# EAGLE design Control de Juez V1.0.0 (EAGLE 9.6.2)
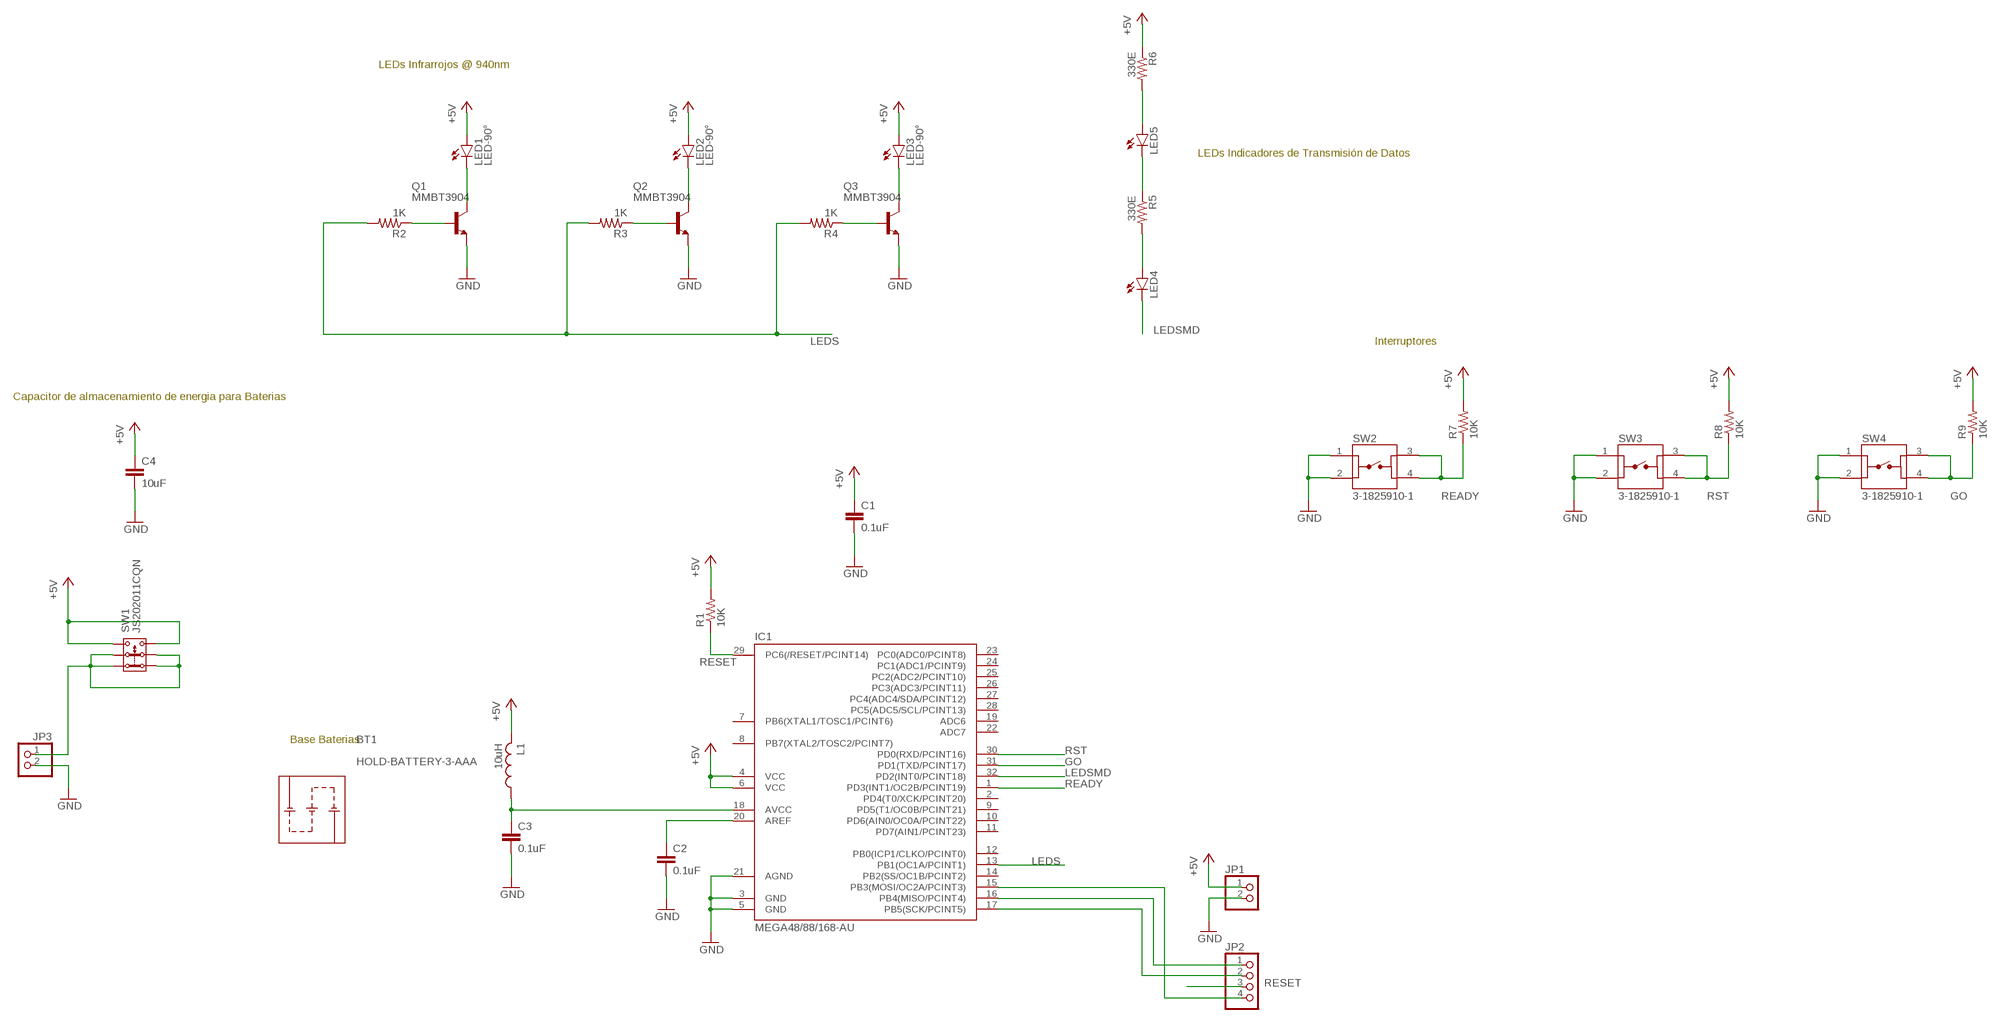
[diagram p0: schematic, sheet 1]

## Parts
BT1  HOLD-BATTERY-3-AAA  [HOLDER-3-AAA]
C1  0.1uF  C-EUC0603  [C0603]
C2  0.1uF  C-EUC0603  [C0603]
C3  0.1uF  C-EUC0603  [C0603]
C4  10uF  C-EUC0603  [C0603]
IC1  MEGA48/88/168-AU  [TQFP32-08]
JP1  PINHD-1X02_2.54-S  [1X02-S]
JP2  PINHD-1X04_2.54-S  [1X04-S]
JP3  PINHD-1X02_2.54-S  [1X02-S]
L1  10uH  L-USL1812  [L1812]
LED1  LED-90°  [LED-90°]
LED2  LED-90°  [LED-90°]
LED3  LED-90°  [LED-90°]
LED4  LEDCHIP-LED0603  [CHIP-LED0603]
LED5  LEDCHIP-LED0603  [CHIP-LED0603]
Q1  MMBT3904  [SOT23]
Q2  MMBT3904  [SOT23]
Q3  MMBT3904  [SOT23]
R1  10K  R-US_R0603  [R0603]
R2  1K  R-US_R0603  [R0603]
R3  1K  R-US_R0603  [R0603]
R4  1K  R-US_R0603  [R0603]
R5  330E  R-US_R0603  [R0603]
R6  330E  R-US_R0603  [R0603]
R7  10K  R-US_R0603  [R0603]
R8  10K  R-US_R0603  [R0603]
R9  10K  R-US_R0603  [R0603]
SW1  JS202011CQN  [PTH]
SW2  3-1825910-1  [TE_3-1825910-1]
SW3  3-1825910-1  [TE_3-1825910-1]
SW4  3-1825910-1  [TE_3-1825910-1]

## Nets
+5V: C1.1 C4.1 IC1.4(VCC) IC1.6(VCC) JP1.1 L1.2 LED1.1(A) LED2.1(A) LED3.1(A) R1.2 R6.1 R7.2 R8.2 R9.2 SW1.3.1 SW1.3.2
GND: C1.2 C2.2 C3.2 C4.2 IC1.3(GND) IC1.5(GND) IC1.21(AGND) JP1.2 JP3.2 Q1.E Q2.E Q3.E SW2.1 SW2.2 SW3.1 SW3.2 SW4.1 SW4.2
GO: IC1.31(PD1(TXD/PCINT17)) R9.1 SW4.3 SW4.4
LEDS: IC1.13(PB1(OC1A/PCINT1)) R2.2 R3.2 R4.2
LEDSMD: IC1.32(PD2(INT0/PCINT18)) LED4.C
N$1: IC1.15(PB3(MOSI/OC2A/PCINT3)) JP2.4
N$2: C3.1 IC1.18(AVCC) L1.1
N$3: C2.1 IC1.20(AREF)
N$4: IC1.16(PB4(MISO/PCINT4)) JP2.1
N$5: IC1.17(PB5(SCK/PCINT5)) JP2.2
N$6: JP3.1 SW1.1.1 SW1.1.2 SW1.2.1 SW1.2.2
N$7: LED1.2(C) Q1.C
N$8: LED2.2(C) Q2.C
N$9: LED3.2(C) Q3.C
N$10: Q3.B R4.1
N$11: Q2.B R3.1
N$12: Q1.B R2.1
N$13: LED5.C R5.1
N$14: LED5.A R6.2
N$15: LED4.A R5.2
READY: IC1.1(PD3(INT1/OC2B/PCINT19)) R7.1 SW2.3 SW2.4
RESET: IC1.29(PC6(/RESET/PCINT14)) JP2.3 R1.1
RST: IC1.30(PD0(RXD/PCINT16)) R8.1 SW3.3 SW3.4
Unconnected: IC1.2(PD4(T0/XCK/PCINT20)) IC1.7(PB6(XTAL1/TOSC1/PCINT6)) IC1.8(PB7(XTAL2/TOSC2/PCINT7)) IC1.9(PD5(T1/OC0B/PCINT21)) IC1.10(PD6(AIN0/OC0A/PCINT22)) IC1.11(PD7(AIN1/PCINT23)) IC1.12(PB0(ICP1/CLKO/PCINT0)) IC1.14(PB2(SS/OC1B/PCINT2)) IC1.19(ADC6) IC1.22(ADC7) IC1.23(PC0(ADC0/PCINT8)) IC1.24(PC1(ADC1/PCINT9)) IC1.25(PC2(ADC2/PCINT10)) IC1.26(PC3(ADC3/PCINT11)) IC1.27(PC4(ADC4/SDA/PCINT12)) IC1.28(PC5(ADC5/SCL/PCINT13))

## Notes on the sheet
- LEDs Infrarrojos @ 940nm
- LEDs Indicadores de Transmisión de Datos
- Interruptores
- Capacitor de almacenamiento de energia para Baterias
- Base Baterias

## Library data of the parts
BT1 = BATTERY_HOLDER_3AAA-C9091:HOLD-BATTERY-3-AAA
C1-C4 = rcl:C-EU: CAPACITOR, European symbol; SPICEPREFIX: C
IC1 = avr-8:MEGA48/88/168
JP1 JP3 = pinhead-2:PINHD-1X02: PIN HEADER
JP2 = pinhead-2:PINHD-1X04: PIN HEADER
L1 = rcl:L-US: INDUCTOR, American symbol; SPICEPREFIX: L
LED1-LED3 = LED_TH-90°:LED-90°
LED4 LED5 = led:LED: LED OSRAM: - CHIPLED LG R971, LG N971, LY N971, LG Q971, LY Q971, LO R971, LY R971 LH N974, LH R974 LS Q976, LO Q976, LY Q976 LO Q996 - Hyper CHIPLED LW Q18S LB Q993, LB Q99A, LB R99A - SideLED LS A670, LO A670, LY A670, LG A670, LP A670 LB A673, LV A673, LT A673, LW A673 LH A674 LY A675 LS A676, LA A676, LO A676, LY A676, LW A676 LS A679, LY A679, LG A679 - Hyper Micro SIDELED® LS Y876, LA Y876, LO Y876, LY Y876 LT Y87S - SmartLED LW L88C, LW L88S LB L89C, LB L89S, LG L890 LS L89K, LO L89K, LY L89K LS L896, LA L896, LO L896, LY L896 - TOPLED LS T670, LO T670, LY T670, LG T670, LP T670 LSG T670, LSP T670, LSY T670, LOP T670, LYG T670 LG T671, LOG T671, LSG T671 LB T673, LV T673, LT T673, LW T673 LH T674 LS T676, LA T676, LO T676, LY T676, LB T676, LH T676, LSB T676, LW T676 LB T67C, LV T67C, LT T67C, LS T67K, LO T67K, LY T67K, LW E67C LS E67B, LA E67B, LO E67B, LY E67B, LB E67C, LV E67C, LT E67C LW T67C LS T679, LY T679, LG T679 LS T770, LO T770, LY T770, LG T770, LP T770 LB T773, LV T773, LT T773, LW T773 LH T774 LS E675, LA E675, LY E675, LS T675 LS T776, LA T776, LO T776, LY T776, LB T776 LHGB T686 LT T68C, LB T68C - Hyper Mini TOPLED® LB M676 - Mini TOPLED Santana® LG M470 LS M47K, LO M47K, LY M47K Source: http://www.osram.convergy.de LUXEON: - LUMILED® LXK2-PW12-R00, LXK2-PW12-S00, LXK2-PW14-U00, LXK2-PW14-V00 LXK2-PM12-R00, LXK2-PM12-S00, LXK2-PM14-U00 LXK2-PE12-Q00, LXK2-PE12-R00, LXK2-PE12-S00, LXK2-PE14-T00, LXK2-PE14-U00 LXK2-PB12-K00, LXK2-PB12-L00, LXK2-PB12-M00, LXK2-PB14-N00, LXK2-PB14-P00, LXK2-PB14-Q00 LXK2-PR12-L00, LXK2-PR12-M00, LXK2-PR14-Q00, LXK2-PR14-R00 LXK2-PD12-Q00, LXK2-PD12-R00, LXK2-PD12-S00 LXK2-PH12-R00, LXK2-PH12-S00 LXK2-PL12-P00, LXK2-PL12-Q00, LXK2-PL12-R00 Source: www.luxeon.com KINGBRIGHT: KA-3528ASYC Source: www.kingbright.com
Q1-Q3 = FAIRCHILD-MMBT3904_Transistor:MMBT3904: FAIRCHILD - MMBT3904 NPN General Purpose Amplifier Description This Device is designed as a general purpose amplifier and switch. The useful dynamic range extends to 100mA as a switch and to 100MHz as an amplifier. Library made By: SOLACE LABS - Applied Research in Motion.
R1-R9 = rcl:R-US_: RESISTOR, American symbol; SPICEPREFIX: R
SW1 = C&K-Slider_Switch:JS202011CQN: C&K Components - JS Series Sub-Miniature Slide Switches ￼Features/Benefits • Positive detent • Low profile • IR reflow to 260o solder profile • Surface and thru hole mounting • SPDT, DPDT, DP3T models • RoHS compliant Specifications CONTACT RATING: See individual series for information. ELECTRICAL LIFE: See individual series for information. CONTACT RESISTANCE: 70 m Ω max. INSULATION RESISTANCE: 100 M Ω min. @ 500V. DIELECTRIC STRENGTH: 500 VAC min. @ sea level. OPERATING TEMPERATURE: -40oC to +85oC STORAGE TEMPERATURE: -40oC to +85oC NOTE: Specifications and materials listed above are for switches with standard options. For information on specific and custom switches, consult Customer Service Center. Library Made By: SOLACE LABS - Applied Research in Motion.
SW2-SW4 = TE-Push_button:3-1825910-1: Switch Tactile OFF (ON) SPST Round Button PC Pins 0.05A 24VDC 100000Cycles 1.57N Thru-Hole Loose; AVAILABILITY: Unavailable; COMMENT: 3-1825910-1; DESCRIPTION: Switch Push Button OFF _ON_ SPST Round Button 0.05A 24VDC Momentary Contact PC Pins Thru-Hole; EU_ROHS_COMPLIANCE: Compliant; MF: TE Connectivity; MP: 3-1825910-1; PACKAGE: None; PRICE: None; TE_PURCHASE_URL: https://www.te.com/usa-en/product-3-1825910-1.html?te_bu=Cor&te_type=disp&te_campaign=seda_glo_cor-seda-global-disp-prtnr-fy19-seda-model-bom-cta_sma-317_1&elqCampaignId=32493

## Board
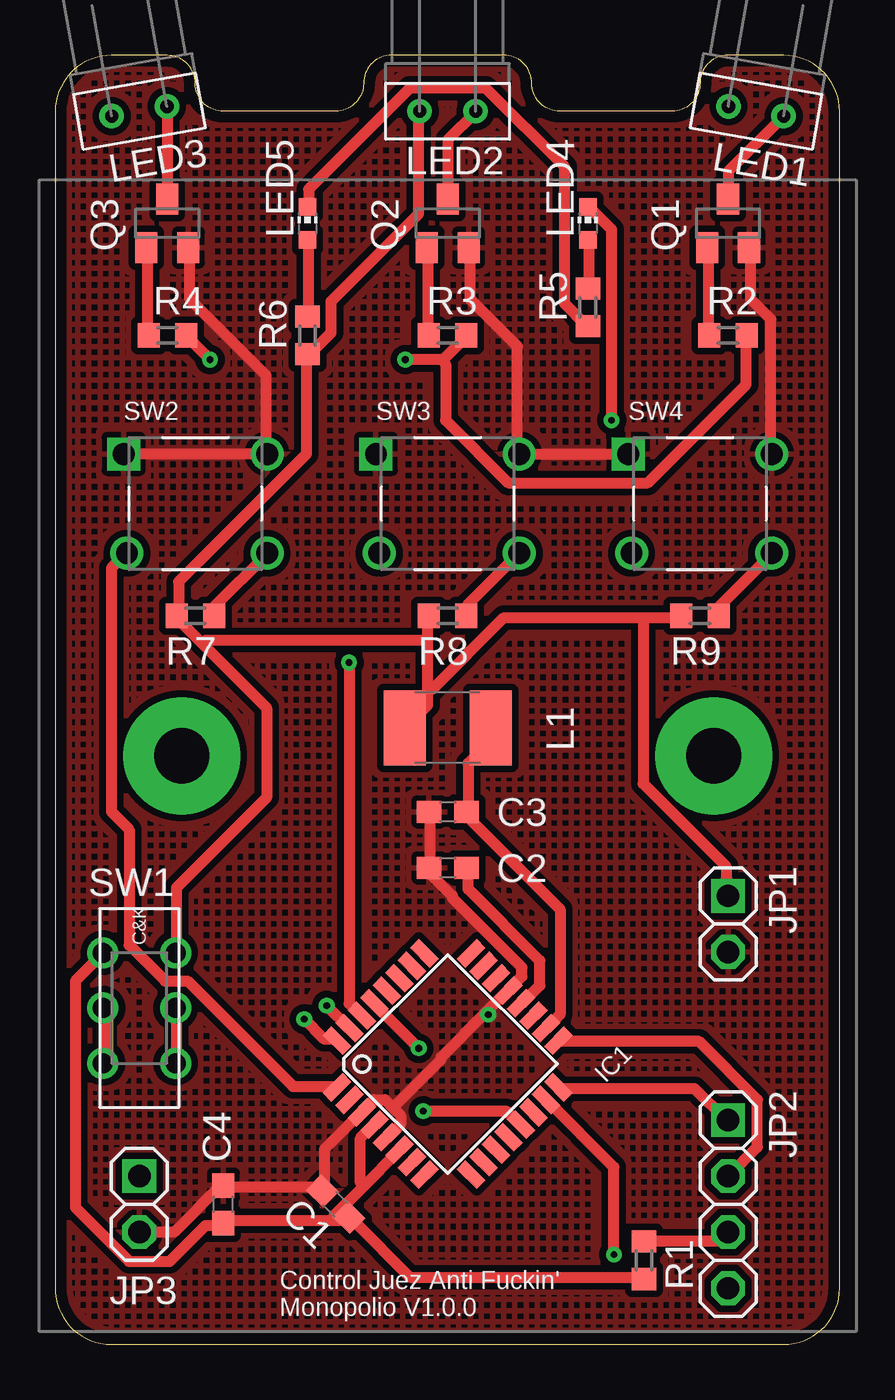
[diagram p1: board, top side]
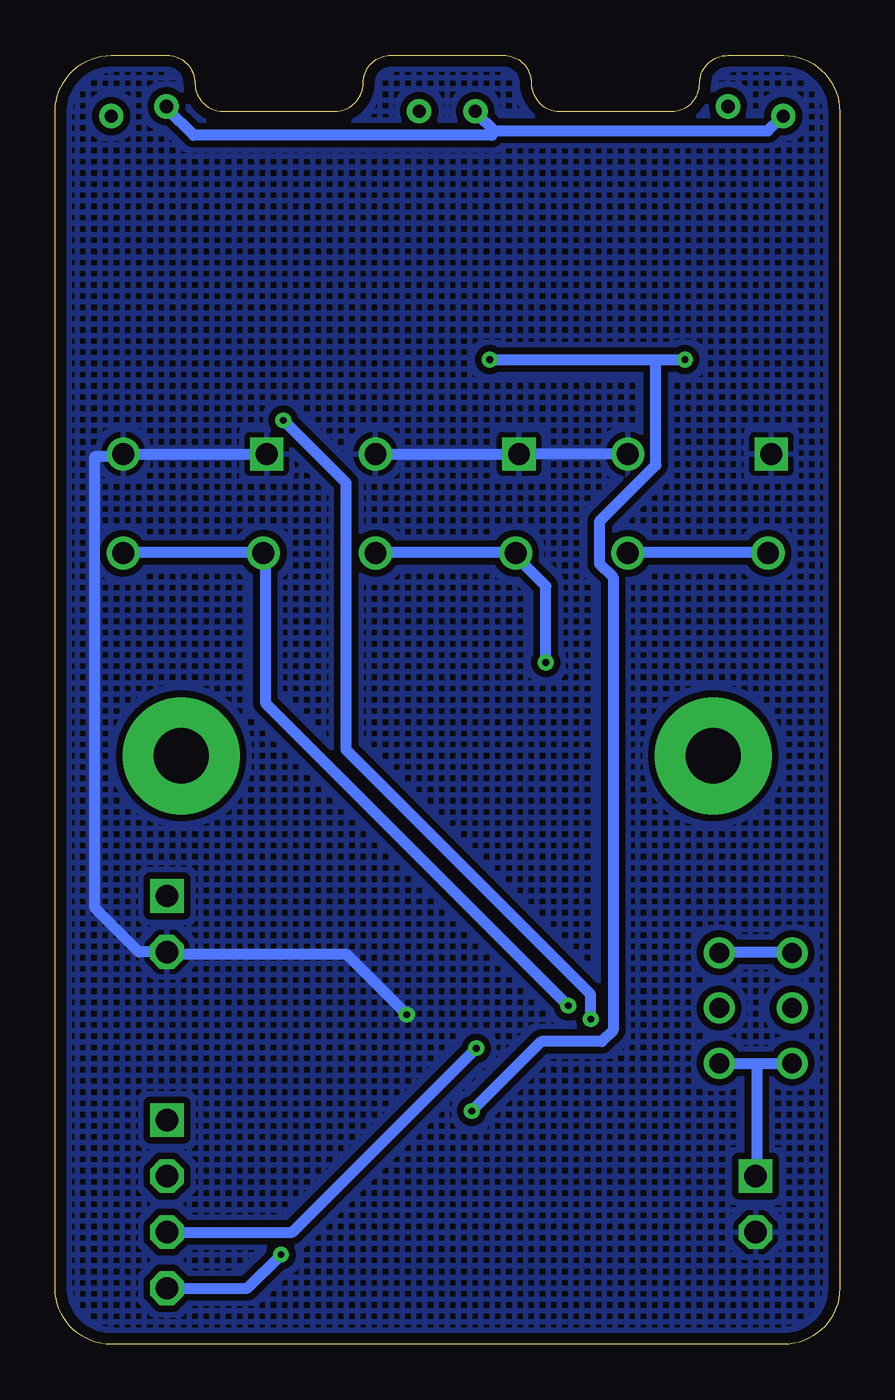
[diagram p2: board, bottom side, seen from below]

Size 35.54 x 58.42 mm. Coordinates in mm from the lower left corner, seen from the top.
Outline: 0,55.87 0,2.54 arc90 2.54,0 33,0 arc90 35.54,2.54 35.54,55.87 arc90 33,58.41 30.48,58.42 arc90 29.21,57.15 arc-90 27.94,55.88 22.86,55.88 arc-90 21.59,57.15 arc90 20.32,58.42 15.24,58.42 arc90 13.97,57.15 arc-90 12.7,55.88 7.61,55.88 arc-90 6.35,57.14 arc90 5.08,58.41 2.54,58.41 arc90 0,55.87
Copper layers (1*16): Top 0.035mm / dielectric 1.5mm / Bottom 0.035mm
Design rules "default *": minimum track width 20mil, minimum drill 12mil, track to track 9mil, track to pad 9mil, pad to pad 9mil, via to via 16mil, smd to smd 0mil, copper to edge 20mil, drill to drill 6mil, minimum pad ring 10mil, minimum via ring 8mil, stop-mask expansion 4mil, vias tented up to drill 12mil, thermal gap 10mil

### Footprints (pad centres in the part's own frame; a part is rotated, then mirrored left to right if it is on the bottom)
HOLDER-3-AAA = drill 2.5 pad 5.3: 1 -12.05,0; 2 12.05,0
C0603 = smd 1.1 x 1: 1 -0.85,0; 2 0.85,0
TQFP32-08 = smd 1.27 x 0.559: 1 -4.293,2.8; 2 -4.293,2; 3 -4.293,1.2; 4 -4.293,0.4; 5 -4.293,-0.4; 6 -4.293,-1.2; 7 -4.293,-2; 8 -4.293,-2.8; 17 4.293,-2.8; 18 4.293,-2; 19 4.293,-1.2; 20 4.293,-0.4; 21 4.293,0.4; 22 4.293,1.2; 23 4.293,2; 24 4.293,2.8 | smd 0.559 x 1.27: 9 -2.8,-4.293; 10 -2,-4.293; 11 -1.2,-4.293; 12 -0.4,-4.293; 13 0.4,-4.293; 14 1.2,-4.293; 15 2,-4.293; 16 2.8,-4.293; 25 2.8,4.293; 26 2,4.293; 27 1.2,4.293; 28 0.4,4.293; 29 -0.4,4.293; 30 -1.2,4.293; 31 -2,4.293; 32 -2.8,4.293
1X02-S = drill 1.016 square: 1 -1.27,0 | drill 1.016 octagon: 2 1.27,0
1X04-S = drill 1.016 square: 1 -3.81,0 | drill 1.016 octagon: 2 -1.27,0; 3 1.27,0; 4 3.81,0
L1812 = smd 1.9 x 3.4: 1 -1.95,0; 2 1.95,0
LED-90° = drill 0.6: 1 -1.27,0; 2 1.27,0
CHIP-LED0603 = smd 0.8 x 0.8: A 0,-0.75; C 0,0.75
SOT23 = smd 1 x 1.4: B -0.95,-1.1; C 0,1.1; E 0.95,-1.1
R0603 = smd 1 x 1.1: 1 -0.85,0; 2 0.85,0
PTH = drill 0.9: 1.1 -2.5,1.65; 1.2 -2.5,-1.65; 2.1 0,1.65; 2.2 0,-1.65; 3.1 2.5,1.65; 3.2 2.5,-1.65
TE_3-1825910-1 = drill 0.99 square: 1 -3.25,2.25 | drill 0.99: 2 3.25,2.25; 3 -3.1,-2.25; 4 3.25,-2.25

### Placement (x,y rotation side)
BT1  17.78,26.67 0 top
C1  12.7,6.35 135 top
C2  17.78,21.59 180 top
C3  17.78,24.13 180 top
C4  7.62,6.35 90 top
IC1  17.78,12.7 45 top
JP1  30.48,19.05 270 top
JP2  30.48,6.35 270 top
JP3  3.81,6.35 270 top
L1  17.78,27.94 180 top
LED1  31.75,55.88 350 top
LED2  17.78,55.88 0 top
LED3  3.81,55.88 10 top
LED4  24.13,50.8 0 top
LED5  11.43,50.8 0 top
Q1  30.48,50.8 0 top
Q2  17.78,50.8 0 top
Q3  5.08,50.8 0 top
R1  26.67,3.81 270 top
R2  30.48,45.72 0 top
R3  17.78,45.72 0 top
R4  5.08,45.72 0 top
R5  24.13,46.99 90 top
R6  11.43,45.72 90 top
R7  6.35,33.02 180 top
R8  17.78,33.02 180 top
R9  29.21,33.02 180 top
SW1  3.81,15.24 90 top
SW2  6.35,38.1 0 top
SW3  17.78,38.1 0 top
SW4  29.21,38.1 0 top

### Tracks (layer width: path | path; a pad name or v marks a point on that pad's centre or on a via)
+5V
  Top 0.508: 16.87,29.68 16.87,28.97 15.86,27.95 L1.2 | 16.87,29.68 16.87,31.91 | 16.87,31.91 16.87,32.93 R8.2 | 26.63,32.93 20.33,32.93 17.08,29.68 16.87,29.68 | 26.63,32.93 28.36,32.93 R9.2 | 26.63,32.93 26.63,25.41 30.39,21.65 30.39,20.33 JP1.1 | C1.1 13.21,5.69 13.11,5.59 7.62,5.59 C4.1 7.42,5.39 6.81,5.39 5.18,3.76 3.35,3.76 0.92,6.2 0.92,16.47 2.13,17.68 SW1.3.1 | R1.2 26.63,3.05 16.06,3.05 13.52,5.59 C1.1 | 13.98,7.17 12.6,5.79 C1.1 | 13.98,7.17 15.55,8.74 IC1.6 | IC1.4 14.43,9.96 13.82,9.35 13.82,7.32 13.98,7.17 | 6.66,31.76 5.59,32.83 R7.2 5.59,33.03 5.59,34.56 11.38,40.35 11.38,44.82 R6.1 11.59,44.92 12.5,45.84 12.5,47.26 16.47,51.23 16.47,55.8 LED2.1 | 6.66,31.76 9.58,28.84 9.58,24.77 5.49,20.68 5.49,17.79 SW1.3.2 | 16.87,31.91 6.81,31.91 6.66,31.76
  Bottom 0.508: 15.65,54.99 3.25,54.99 2.64,55.6 LED3.1 | 15.65,54.99 16.47,55.8 LED2.1 | LED1.1 30.49,56 29.27,54.78 15.75,54.78 15.65,54.99 | SW1.3.1 2.24,17.79 5.39,17.79 SW1.3.2
GND  (via drill 0.3)
  Top 0.508: C3.2 16.97,24.09 16.97,21.65 C2.2 16.97,21.34 17.99,20.33 17.99,20.23 21.14,17.08 21.14,16.67 20.63,16.16 IC1.21 20.53,16.06 19.52,15.04 | 15.3,10.72 14.94,11.08 14.43,11.08 14.03,10.67 IC1.3 13.82,10.47 12.2,8.84 12.2,7.01 C1.2 11.89,7.12 7.62,7.12 C4.2 7.42,7.12 5.39,5.08 3.86,5.08 JP3.2 | 15.3,10.72 15.65,10.37 15.65,9.96 15.04,9.35 IC1.5 | 19.52,15.04 17.48,13.01 17.48,12.91 15.45,10.88 15.3,10.72 | Q3.E 6.1,49.6 6.1,47.36 9.55,43.91 9.55,40.35 SW2.2 9.35,40.35 3.15,40.35 SW2.1 | Q2.E 18.8,49.6 18.8,47.36 20.94,45.23 20.94,40.35 SW3.2 21.24,40.35 25.92,40.35 SW4.1 | Q1.E 31.51,49.6 31.51,47.36 32.42,46.45 32.42,40.35 SW4.2 | v19.62,14.94 19.52,15.04
  Bottom 0.508: SW2.2 9.66,40.35 14.43,40.35 SW3.1 14.74,40.35 20.94,40.35 SW3.2 | 30.49,17.79 JP1.2 | SW4.1 26.02,40.35 32.22,40.35 SW4.2 32.52,40.25 33.74,40.25 33.74,19.77 31.75,17.78 JP1.2 | v19.62,14.94 22.36,17.68 30.29,17.68 JP1.2
  pour Top (isolate 0.305, hatched): 29.21,57.15 arc-90 30.48,58.42 33.02,58.42 arc-90 35.56,55.88 35.56,2.54 arc-90 33.02,0 2.54,0 arc-90 0,2.54 0,55.88 arc-90 2.54,58.42 5.08,58.42 arc-90 6.35,57.15 arc90 7.62,55.88 12.7,55.88 arc90 13.97,57.15 arc-90 15.24,58.42 20.32,58.42 arc-90 21.59,57.15 arc90 22.86,55.88 27.94,55.88 arc90
  pour Bottom (isolate 0.305, hatched): 29.21,57.15 arc-90 30.48,58.42 33.02,58.42 arc-90 35.56,55.88 35.56,2.54 arc-90 33.02,0 2.54,0 arc-90 0,2.54 0,55.88 arc-90 2.54,58.42 5.08,58.42 arc-90 6.35,57.15 arc90 7.62,55.88 12.7,55.88 arc90 13.97,57.15 arc-90 15.24,58.42 20.32,58.42 arc-90 21.59,57.15 arc90 22.86,55.88 27.94,55.88 arc90
GO  (via drill 0.3)
  Top 0.508: R9.1 30.09,33.03 30.09,33.44 32.42,35.78 SW4.4 | v12.3,15.35 13.31,14.33 IC1.31
  Bottom 0.508: v12.3,15.35 26.02,29.07 26.02,35.78 SW4.3 26.32,35.88 32.42,35.88 SW4.4
LEDS  (via drill 0.3)
  Top 0.508: v7.01,44.62 6,45.64 R4.2 | 17.58,44.62 v15.86,44.62 | 17.58,44.62 18.6,45.64 R3.2 | R2.2 31.3,45.64 31.3,43.5 26.83,39.03 20.53,39.03 17.68,41.88 17.68,44.42 17.58,44.62 | v16.67,10.57 20.43,10.57 21.04,9.96 IC1.13
  Bottom 0.508: v15.86,44.62 8.33,44.62 | 8.33,44.62 v7.01,44.62 | v16.67,10.57 13.52,13.72 10.77,13.72 10.27,14.23 10.27,34.76 10.88,35.37 10.88,37.3 8.33,39.84 8.33,44.62
LEDSMD  (via drill 0.3)
  Top 0.508: v25.21,41.88 25.21,50.52 24.19,51.53 LED4.C | v11.28,14.74 12.2,13.82 12.71,13.82 IC1.32
  Bottom 0.508: v25.21,41.88 22.36,39.03 22.36,26.93 11.28,15.86 v11.28,14.74
N$1  (via drill 0.3)
  Top 0.508: v25.31,4.07 25.31,8.03 22.26,11.08 IC1.15
  Bottom 0.508: v25.31,4.07 26.83,2.54 30.39,2.54 JP2.4
N$2
  Top 0.508: L1.1 19.72,27.85 19.72,27.34 18.7,26.32 18.7,24.19 C3.1 18.7,23.89 22.87,19.72 22.87,14.94 22.26,14.33 IC1.18
N$3
  Top 0.508: C2.1 18.7,21.55 18.7,20.63 21.95,17.38 21.95,16.26 21.14,15.45 IC1.20
N$4
  Top 0.508: IC1.16 22.87,11.59 28.97,11.59 30.39,10.16 JP2.1
N$5
  Top 0.508: IC1.17 22.87,13.72 29.17,13.72 31.81,11.08 31.81,8.94 30.49,7.62 JP2.2
N$6
  Top 0.508: SW1.1.2 5.49,12.81 5.49,15.14 SW1.2.2 | SW1.1.1 2.24,12.81 2.24,15.14 SW1.2.1
  Bottom 0.508: 3.76,12.71 3.76,7.62 JP3.1 | 3.76,12.71 2.24,12.71 SW1.1.1 | 3.76,12.71 5.39,12.71 SW1.1.2
N$7
  Top 0.508: Q1.C 30.49,51.94 30.49,53.16 32.93,55.6 LED1.2
N$8
  Top 0.508: Q2.C 17.79,51.94 17.79,54.58 19.01,55.8 LED2.2
N$9
  Top 0.508: Q3.C 5.08,51.94 5.08,56 LED3.2
N$10
  Top 0.508: R4.1 4.17,45.74 4.17,49.6 Q3.B
N$11
  Top 0.508: R3.1 16.87,45.74 16.87,49.6 Q2.B
N$12
  Top 0.508: R2.1 29.58,45.74 29.58,49.6 Q1.B
N$13
  Top 0.508: LED5.C 11.48,51.63 11.48,52.34 16.06,56.92 19.52,56.92 23.07,53.36 23.07,47.16 24.09,46.15 R5.1
N$14
  Top 0.508: LED5.A 11.48,50.01 11.48,46.65 R6.2
N$15
  Top 0.508: LED4.A 24.19,50.01 24.19,47.87 R5.2
READY
  Top 0.508: R7.1 7.22,33.03 7.22,33.44 9.55,35.78 SW2.4 | IC1.1 12.71,11.69 10.77,11.69 6,16.47 4.98,16.47 3.35,18.09 3.35,23.33 2.54,24.14 2.54,35.17 3.15,35.78 SW2.3
  Bottom 0.508: SW2.4 9.55,35.88 3.25,35.88 SW2.3
RESET  (via drill 0.3)
  Top 0.508: R1.1 26.73,4.67 30.09,4.67 30.39,4.98 JP2.3 | v16.47,13.42 14.43,15.45 IC1.29
  Bottom 0.508: v16.47,13.42 24.8,5.08 30.39,5.08 JP2.3
RST  (via drill 0.3)
  Top 0.508: R8.1 18.7,33.03 18.7,33.54 20.94,35.78 SW3.4 | v13.31,30.9 13.31,15.45 13.82,14.94 IC1.30
  Bottom 0.508: 14.64,35.78 SW3.3 14.84,35.88 | 14.84,35.88 20.94,35.88 SW3.4 | v13.31,30.9 13.31,34.35 14.84,35.88

### Text on the board
tPlace: Control Juez Anti Fuckin' / Monopolio V1.0.0